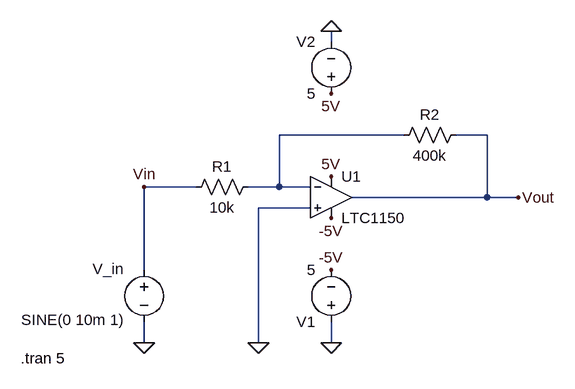
[diagram p0: schematic inverting_op_amp.asc]
inverting_op_amp.asc, the LTspice schematic file:
Version 4
SHEET 1 880 680
WIRE 192 -48 192 -64
WIRE 304 96 112 96
WIRE 432 96 384 96
WIRE -16 176 -96 176
WIRE 112 176 112 96
WIRE 112 176 64 176
WIRE 160 176 112 176
WIRE 432 192 432 96
WIRE 432 192 224 192
WIRE 480 192 432 192
WIRE 160 208 80 208
WIRE -96 304 -96 176
WIRE -96 416 -96 384
WIRE 80 416 80 208
WIRE 192 416 192 384
FLAG 192 416 0
FLAG 192 -64 0
FLAG 480 192 Vout
FLAG -96 416 0
FLAG -96 176 Vin
FLAG 80 416 0
FLAG 192 304 -5V
FLAG 192 224 -5V
FLAG 192 32 5V
FLAG 192 160 5V
SYMBOL voltage 192 400 R180
WINDOW 123 0 0 Left 0
WINDOW 39 0 0 Left 0
SYMATTR InstName V1
SYMATTR Value 5
SYMBOL voltage 192 48 R180
WINDOW 0 24 96 Left 2
WINDOW 3 24 16 Left 2
WINDOW 123 0 0 Left 0
WINDOW 39 0 0 Left 0
SYMATTR InstName V2
SYMATTR Value 5
SYMBOL res 80 160 R90
WINDOW 0 0 56 VBottom 2
WINDOW 3 32 56 VTop 2
SYMATTR InstName R1
SYMATTR Value 10k
SYMBOL res 400 80 R90
WINDOW 0 0 56 VBottom 2
WINDOW 3 32 56 VTop 2
SYMATTR InstName R2
SYMATTR Value 400k
SYMBOL OpAmps\\LTC1150 192 128 R0
SYMATTR InstName U1
SYMBOL voltage -96 288 R0
WINDOW 0 -79 14 Left 2
WINDOW 3 -189 93 Left 2
WINDOW 123 0 0 Left 0
WINDOW 39 0 0 Left 0
SYMATTR InstName V_in
SYMATTR Value SINE(0 10m 1)
TEXT -286 440 Left 2 !.tran 5

The netlist it stands for:
* inverting_op_amp.asc
V1 0 -5V 5
V2 5V 0 5
R1 N001 Vin 10k
R2 Vout N001 400k
XU1 0 N001 5V -5V Vout LTC1150  ; pins In+ In- V+ V- OUT
V_in Vin 0 SINE(0 10m 1)
.tran 5
.lib LTC.lib
.backanno
.end

* Results of the author's LTspice run, read from the files saved beside the schematic
* Operating Point, zero values left out:
*   V(-5v) = -5 V
*   V(5v) = 5 V
*   I(V2) = -799.1 µA
*   I(V1) = -799.1 µA
*   Ix(u1:3) = 799.1 µA
*   Ix(u1:4) = -799.1 µA
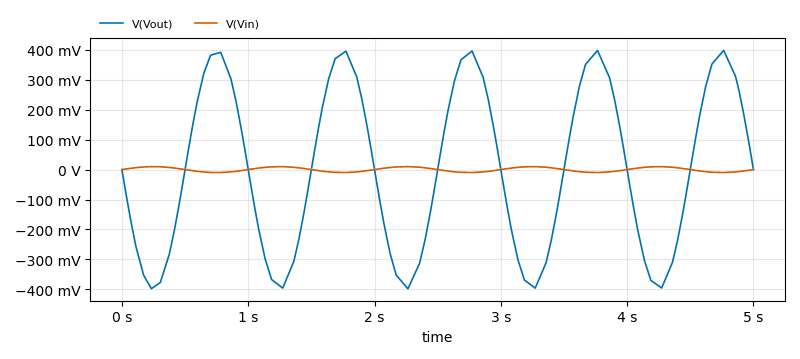
[diagram p1: Transient Analysis of inverting_op_amp.asc, plotted from the saved traces]
* Transient Analysis, 1 run:
*   V(Vout): min -398 mV, max 398 mV, average -143.4 µV, rms 279.2 mV, last 3.419 µV
*   V(Vin): min -9.953 mV, max 9.953 mV, average 3.587 µV, rms 6.98 mV, last 0 V